# Altium schematic sheet OurEDA-P1K_PowerManagement.SchDoc
size A4; SheetNumber: 1; SheetTotal: 7
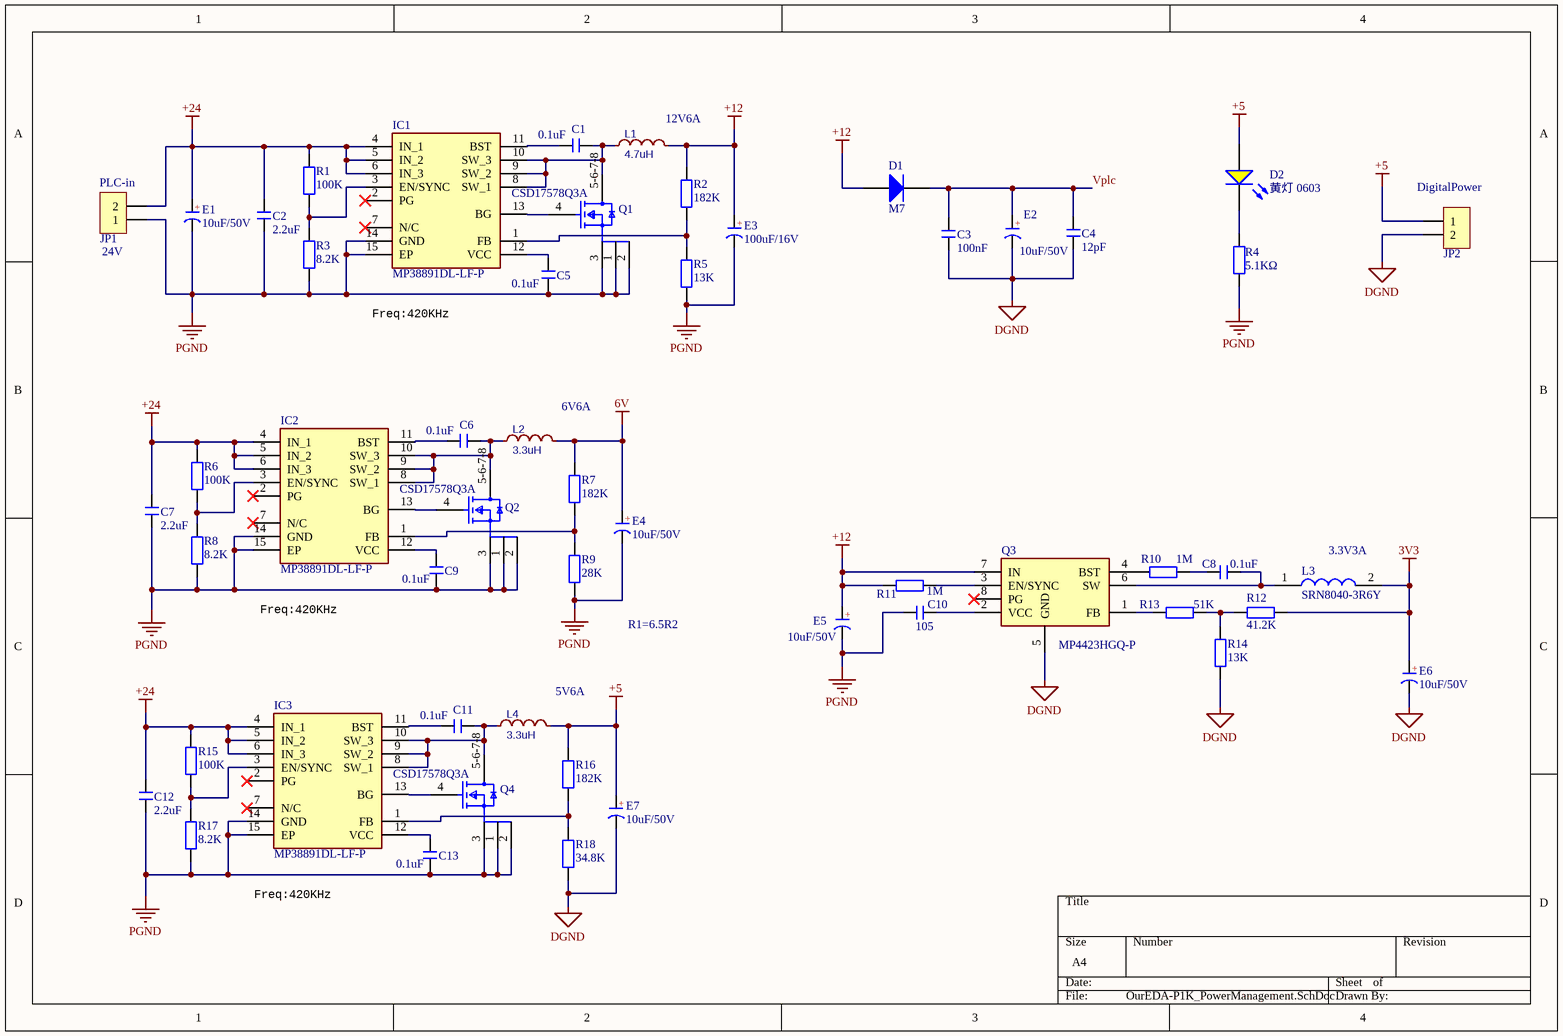
[diagram p0: OurEDA-P1K_PowerManagement.SchDoc]

## Parts
C1  0.1uF  [C 0603_L]
C2  2.2uF  [C 0805_L]
C3  100nF  [C 0603_L]
C4  12pF  [C 0603_L]
C5  0.1uF  [C 0603_L]
C6  0.1uF  [C 0603_L]
C7  2.2uF  [C 0805_L]
C8  0.1uF  [C 0603_L]
C9  0.1uF  [C 0603_L]
C10  105  [C 0603_L]
C11  0.1uF  [C 0603_L]
C12  2.2uF  [C 0805_L]
C13  0.1uF  [C 0603_L]
D1  M7  [SMA(DO-214AC)_S1]
D2  黄灯 0603  [0603_LED_S1]
E1  10uF/50V  [CM D(6.3*5.4)]
E2  10uF/50V  [CM B(4*5.4)]
E3  100uF/16V  [CM D(6.3*5.4)]
E4  10uF/50V  [CM B(4*5.4)]
E5  10uF/50V  [CM B(4*5.4)]
E6  10uF/50V  [CM B(4*5.4)]
E7  10uF/50V  [CM B(4*5.4)]
IC1  MP38891DL-LF-P  [SON50P300X400X100-15N-D]
IC2  MP38891DL-LF-P  [SON50P300X400X100-15N-D]
IC3  MP38891DL-LF-P  [SON50P300X400X100-15N-D]
JP1  HDR-1X2  [KF128-5.08-2P]  (value not drawn)
JP2  HDR-1X2  [HDR2.54-LI-2P]  (value not drawn)
L1  4.7uH  [220uH]
L2  3.3uH  [220uH]
L3  SRN8040-3R6Y  [SRN80408R2Y]
L4  3.3uH  [220uH]
Q1  CSD17578Q3A  [FP-DNH0008A-MFG]
Q2  CSD17578Q3A  [FP-DNH0008A-MFG]
Q3  MP4423HGQ-P  [MP4423GQP]
Q4  CSD17578Q3A  [FP-DNH0008A-MFG]
R1  100K  [R 0603_L]
R2  182K  [R 0603_L]
R3  8.2K  [R 0603_L]
R4  5.1KΩ  [0603_R]
R5  13K  [R 0603_L]
R6  100K  [R 0603_L]
R7  182K  [R 0603_L]
R8  8.2K  [R 0603_L]
R9  28K  [R 0603_L]
R10  1M  [R 0603_L]
R11  1M  [R 0603_L]
R12  41.2K  [R 0603_L]
R13  51K  [R 0603_L]
R14  13K  [R 0603_L]
R15  100K  [R 0603_L]
R16  182K  [R 0603_L]
R17  8.2K  [R 0603_L]
R18  34.8K  [R 0603_L]

## Nets
3V3: E6.1(A) L3.2 R12.2
6V: E4.1(A) L2.2 R7.2
+5: D2.A E7.1(A) JP2.1 L4.2 R16.2
+12: D1.1(A) E3.1(A) E5.1(A) L1.2 Q3.7(IN) R2.2 R11.2
+24: C2.2 C7.2 C12.2 E1.1(A) IC1.4(IN_1) IC1.5(IN_2) IC1.6(IN_3) IC2.4(IN_1) IC2.5(IN_2) IC2.6(IN_3) IC3.4(IN_1) IC3.5(IN_2) IC3.6(IN_3) JP1.2 R1.2 R6.2 R15.2
DGND: C3.2 C4.2 E2.2(K) E6.2(K) E7.2(K) JP2.2 Q3.5(GND) R14.2 R18.1
PGND: C2.1 C5.2 C7.1 C9.2 C10.1 C12.1 C13.2 E1.2(K) E3.2(K) E4.2(K) E5.2(K) IC1.14(GND) IC1.15(EP) IC2.14(GND) IC2.15(EP) IC3.14(GND) IC3.15(EP) JP1.1 Q1.1(S) Q1.2(S) Q1.3(S) Q2.1(S) Q2.2(S) Q2.3(S) Q4.1(S) Q4.2(S) Q4.3(S) R3.1 R4.2 R5.1 R8.1 R9.1 R17.1
Vplc: C3.1 C4.1 D1.2(K) E2.1(A)
NetC1_1: C1.1 IC1.8(SW_1) IC1.9(SW_2) IC1.10(SW_3) L1.1 Q1.5-6-7-8(D)
NetC1_2: C1.2 IC1.11(BST)
NetC5_1: C5.1 IC1.12(VCC)
NetC6_1: C6.1 IC2.8(SW_1) IC2.9(SW_2) IC2.10(SW_3) L2.1 Q2.5-6-7-8(D)
NetC6_2: C6.2 IC2.11(BST)
NetC8_1: C8.1 L3.1 Q3.6(SW)
NetC8_2: C8.2 R10.1
NetC9_1: C9.1 IC2.12(VCC)
NetC10_2: C10.2 Q3.2(VCC)
NetC11_1: C11.1 IC3.8(SW_1) IC3.9(SW_2) IC3.10(SW_3) L4.1 Q4.5-6-7-8(D)
NetC11_2: C11.2 IC3.11(BST)
NetC13_1: C13.1 IC3.12(VCC)
NetD2_K: D2.K R4.1
NetIC1_1: IC1.1(FB) R2.1 R5.2
NetIC1_3: IC1.3(EN/SYNC) R1.1 R3.2
NetIC1_13: IC1.13(BG) Q1.4(G)
NetIC2_1: IC2.1(FB) R7.1 R9.2
NetIC2_3: IC2.3(EN/SYNC) R6.1 R8.2
NetIC2_13: IC2.13(BG) Q2.4(G)
NetIC3_1: IC3.1(FB) R16.1 R18.2
NetIC3_3: IC3.3(EN/SYNC) R15.1 R17.2
NetIC3_13: IC3.13(BG) Q4.4(G)
NetQ3_1: Q3.1(FB) R13.2
NetQ3_3: Q3.3(EN/SYNC) R11.1
NetQ3_4: Q3.4(BST) R10.2
NetR12_1: R12.1 R13.1 R14.1

Not connected (* = marked no-connect by the designer): IC1 2(PG)* 7(N/C)*; IC2 2(PG)* 7(N/C)*; IC3 2(PG)* 7(N/C)*; Q3 8(PG)*

## Notes on the sheet
- (near L1) 12V6A
- (near JP1) PLC-in
- (near JP2) DigitalPower
- (near JP1) 24V
- Freq:420KHz
- (near L2) 6V6A
- (near L3) 3.3V3A
- R1=6.5R2
- (near L4) 5V6A
- (in symbol C-CM) +

## Library data of the parts
C1-C13 = C: 无极性贴片电容; 版权归属: 源创客; BOM名称: 无极性贴片电容; 学习资源: www.ooocke.com
D1 = SMA(DO-214AC) M7: 二极管; Notepad: 1N4007 4007 编号C2464 已经停售, 使用新物料编号C95872; ComponentLink1Description: 供应商链接; ComponentLink1URL: http://www.szlcsc.com/product/details_2841.html; Package: SMA(DO-214AC); Supplier: LC; SuppliersPartNumber: C95872
D2 = 0603 黄灯: 发光二极管; ComponentLink1Description: 供应商链接; ComponentLink1URL: http://www.szlcsc.com/product/details_73147.html; Package: 0603; Supplier: LC; SuppliersPartNumber: C72038
E1-E7 = C-CM: 贴片电解电容; 版权归属: 源创客; BOM名称: 贴片电解电容; 学习资源: www.ooocke.com
IC1-IC3 = MP38891DL-LF-P: Integrated Circuit; Manufacturer_Name: Monolithic Power Systems (MPS); Datasheet Link: https://componentsearchengine.com/Datasheets/1/MP38891DL-LF-P.pdf; Height: 1mm; Manufacturer_Part_Number: MP38891DL-LF-P; Mouser Part Number: 946-MP38891DLLFP; Mouser Price/Stock: https://www.mouser.com/Search/Refine.aspx?Keyword=946-MP38891DLLFP
JP1 JP2 = Header 2: 2P接插件; 版权归属: 源创客; BOM名称: 2P接插件; 学习资源: www.ooocke.com
L1 L2 L4 = 220uH: BOM_Manufacturer: Sunltech Tech; BOM_Manufacturer Part: SLO1235H220MTT; nameAlias: Inductance; Contributor: LCSC; BOM_Supplier: LCSC; BOM_Supplier Part: C364099; spicePre: L; spiceSymbolName: SLO1235H220MTT
L3 = SRN8040-3R6Y: Inductor; Manufacturer_Name: Bourns; Datasheet Link: https://www.bourns.com/docs/Product-Datasheets/SRN8040.pdf; Height: 4mm; Manufacturer_Part_Number: SRN8040-3R6Y; Arrow Part Number: SRN8040-3R6Y; Arrow Price/Stock: https://www.arrow.com/en/products/srn8040-3r6y/bourns; Mouser Part Number: 652-SRN8040-3R6Y; Mouser Price/Stock: https://www.mouser.com/Search/Refine.aspx?Keyword=652-SRN8040-3R6Y
Q1 Q2 Q4 = CMP-04962-000065-1: MOSFET N-CH 30V 35A 8VSON; Turn-On Delay Time: 2ns; Rds On Max: 7.3mR; Fall Time: 1ns; Gate to Source Voltage (Vgs): 20V; Turn-Off Delay Time: 13ns; Rise Time: 6ns; Max Power Dissipation: 3.2W; Input Capacitance: 1.59nF; Element Configuration: Single; Continuous Drain Current (ID): 20A; Drain to Source Voltage (Vdss): 30V; Packaging: Tape and Reel; Lead Free: Lead Free; Mount: Surface Mount; Number of Pins: 8; Contact Plating: Copper; Min Operating Temperature: -55°C; Max Operating Temperature: 150°C; RoHS Compliant: Yes
Q3 = MP4423HGQ-P: Transistor; Manufacturer_Name: Monolithic Power Systems (MPS); Datasheet Link: https://componentsearchengine.com/Datasheets/1/MP4423HGQ-P.pdf; Height: 1mm; Manufacturer_Part_Number: MP4423HGQ-P; Mouser Part Number: 946-MP4423HGQ-P; Mouser Price/Stock: https://www.mouser.co.uk/ProductDetail/Monolithic-Power-Systems-MPS/MP4423HGQ-P?qs=493kPxzlxfL2LSjJYToBPQ%3D%3D
R1-R3 R5-R18 = R: 贴片电阻; 版权归属: 源创客; BOM名称: 贴片电阻; 学习资源: www.ooocke.com
R4 = 0603 3.3KΩ (3301) 1%: 贴片电阻; ComponentLink1Description: 供应商链接; ComponentLink1URL: http://www.szlcsc.com/product/details_23705.html; Package: 0603; Supplier: LC; SuppliersPartNumber: C22978